# Altium schematic sheet FPGA_CFG.SchDoc: TE0722
size A4; Organization: Trenz Electronic GmbH; DocumentNumber: 4; Revision: 01; SheetNumber: 4; SheetTotal: 8; Date: 07.11.2014; PageSetup: Record=PageOptions|CenterHorizontal=True|CenterVertical=True|PrintScale=0.96|XCorrection=1.00|YCorrection=1.00|PrintKind=0|BorderSize=5000000|LeftOffset=0|BottomOffset=0|Orientation=2|PaperLength=1000|PaperWidth=1000|Scale=100|PaperSource=7|PrintQuality=-4|MediaType=1|DitherType=10|PaperKind=A4|PrintScaleMode=1
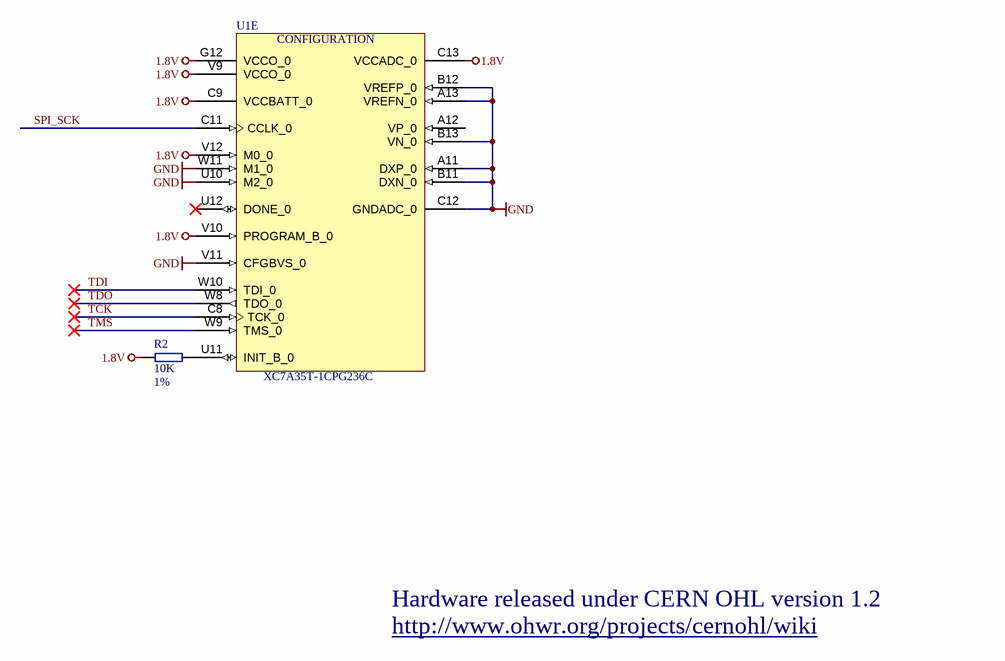
[diagram p0: FPGA_CFG.SchDoc]

## Parts
R2  10K  Tolerance: 1%  [RESC0603X26N]
U1  XC7A35T-1CPG236C  [XC7AxxT-CPG236]  (part E of 8)

## Nets
1.8V: R2.1 U1.C9(VCCBATT_0) U1.C13(VCCADC_0) U1.G12(VCCO_0) U1.V9(VCCO_0) U1.V10(PROGRAM_B_0) U1.V12(M0_0)
GND: U1.A11(DXP_0) U1.A13(VREFN_0) U1.B11(DXN_0) U1.B12(VREFP_0) U1.B13(VN_0) U1.C12(GNDADC_0) U1.U10(M2_0) U1.V11(CFGBVS_0) U1.W11(M1_0)
SPI_SCK: U1.C11(CCLK_0)
TCK: U1.C8(TCK_0)
TDI: U1.W10(TDI_0)
TDO: U1.W8(TDO_0)
TMS: U1.W9(TMS_0)
NetR2_2: R2.2 U1.U11(INIT_B_0)

Not connected (* = marked no-connect by the designer): U1 A12(VP_0) U12(DONE_0)*

## Notes on the sheet
- Hardware released under CERN OHL version 1.2
- http://www.ohwr.org/projects/cernohl/wiki
- Title:
- Nummer:
- Rev.
- Datum:
- A4
- Zeichner:
- Blatt
- von
- Filename:
- (in symbol 26752, part E) CONFIGURATION

## Library data of the parts
R2 = 24914: WID SMD 10K 1% 0,05W; AN: 24914; Mixed: SMT; Preferred: Yes; Case: 0603 (0201); Value: 10K; HelpURL: B:\AD\adlib\datasheet\R0201
U1 = 26752: AN: 26752; Mixed: SMT; Trenz-Stock: Yes; Case: CPG236; HelpURL: B:\ad\adlib\datasheet\XC7